# Altium project jetson-orin-baseboard.PrjPcb (part 2 of 5)

## Sheet supply.SchDoc
size 420 x 297 mm
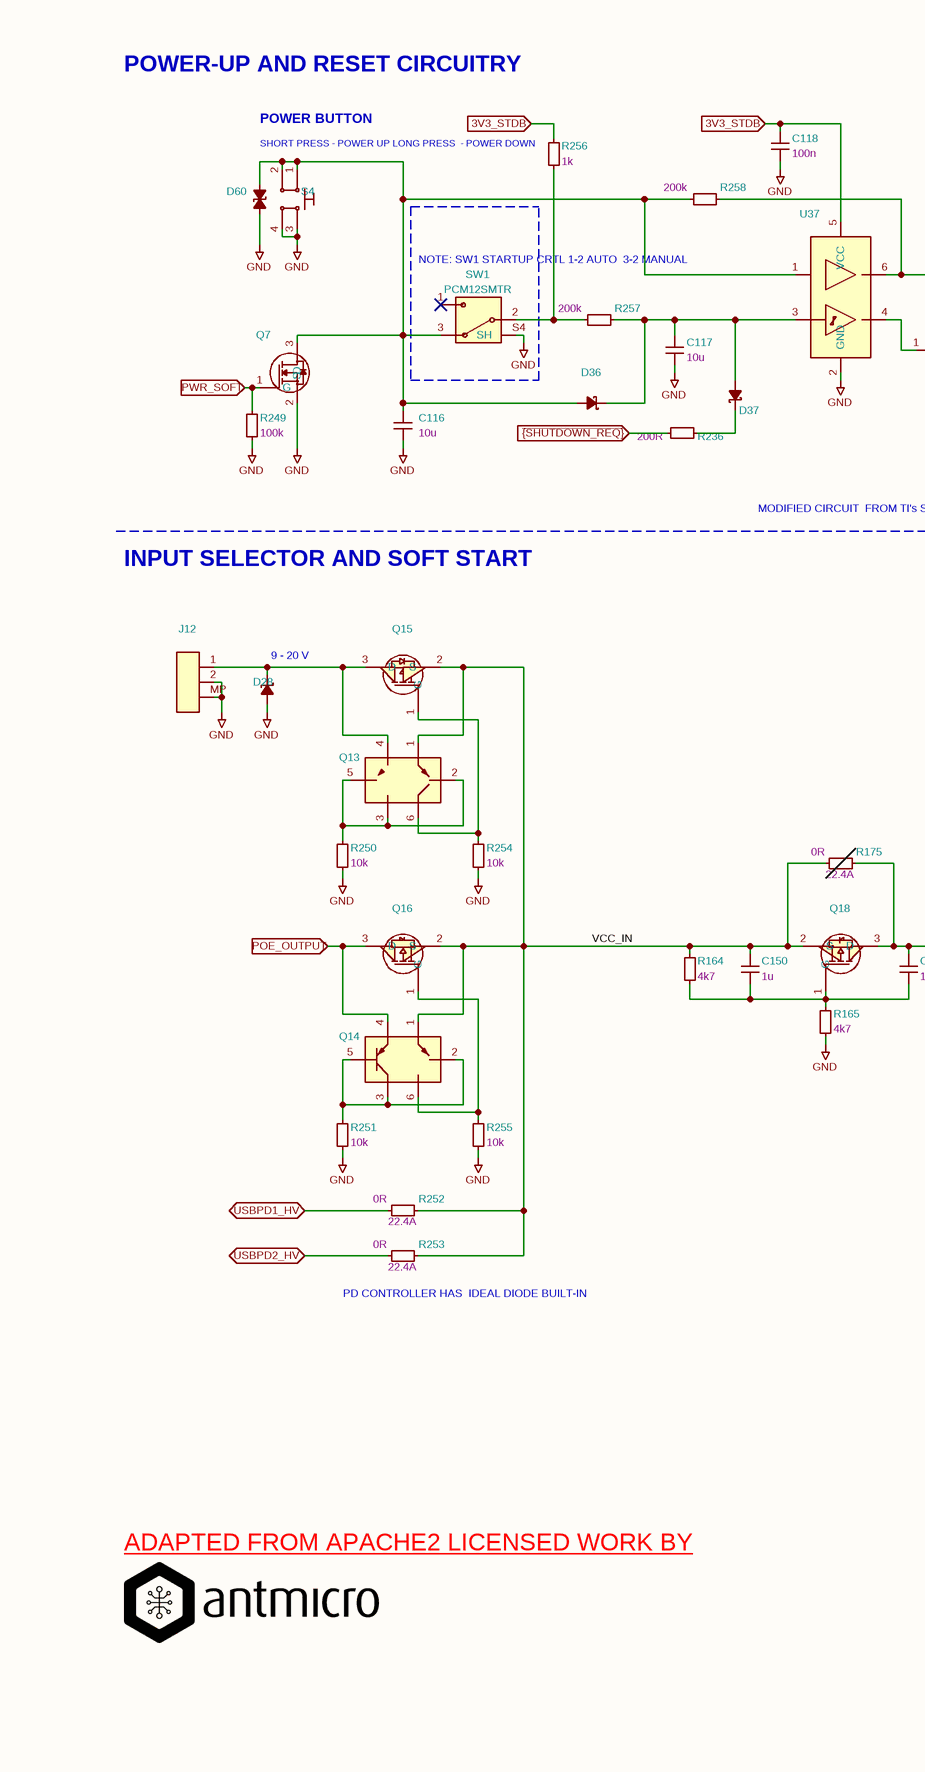
[diagram p3: supply.SchDoc, left]
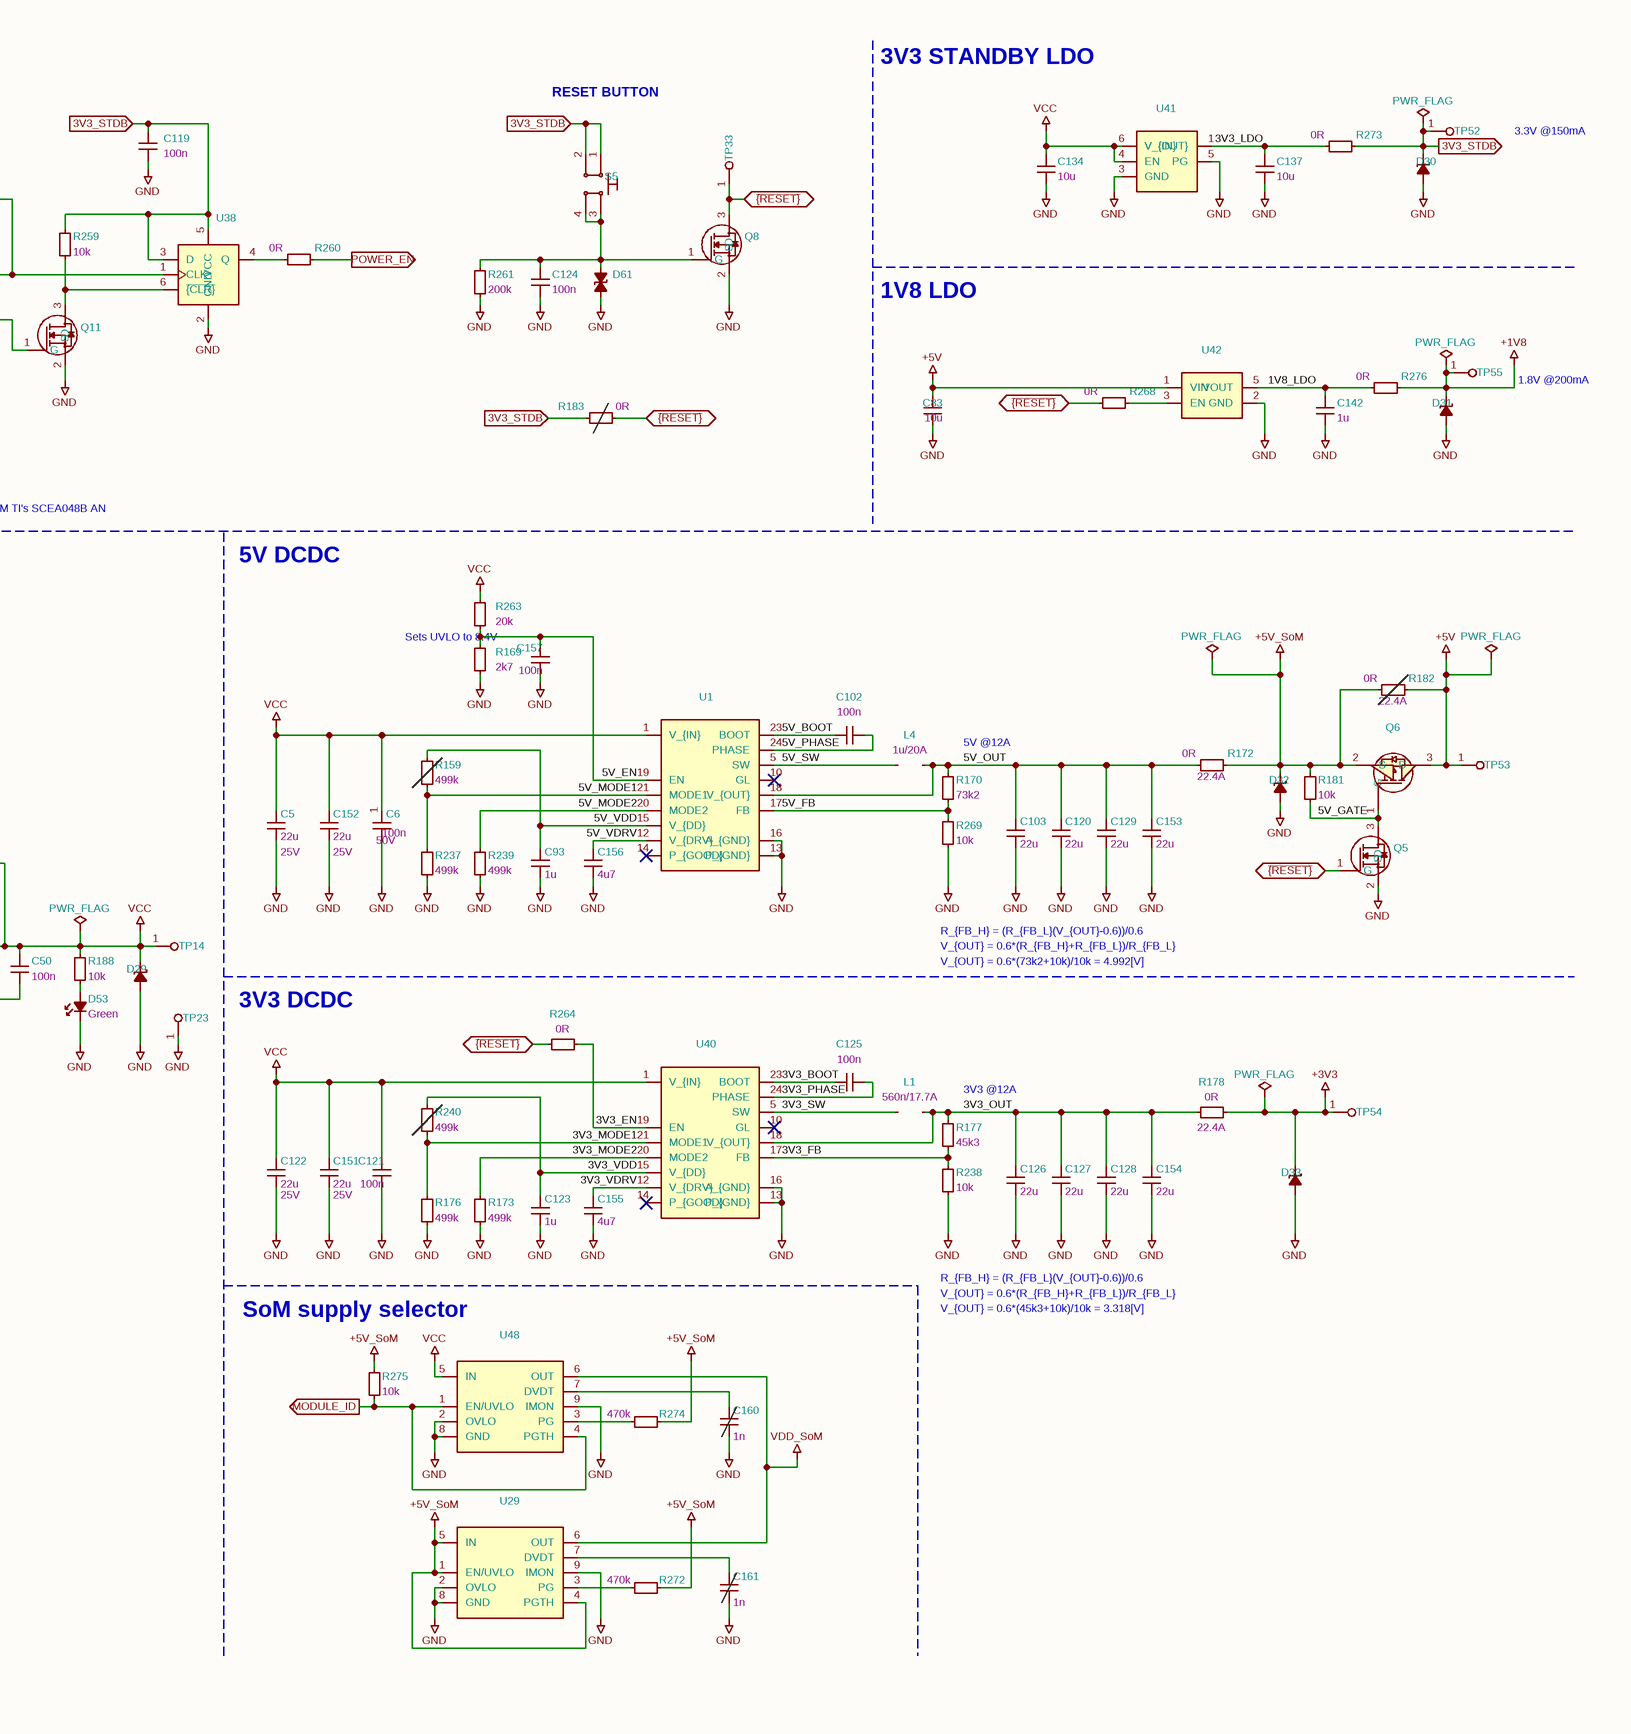
[diagram p4: supply.SchDoc, right]

### Parts
#FLG01  PWR_FLAG  (graphical)
#FLG03  PWR_FLAG  (graphical)
#FLG04  PWR_FLAG  (graphical)
#FLG05  PWR_FLAG  (graphical)
#FLG06  PWR_FLAG  (graphical)
#FLG011  PWR_FLAG  (graphical)
C5  Val: 22u  Voltage: 25V  [C_0805_2012Metric]  (hidden comment: CL21A226MAYNNNE)
C6  Val: 100n  Voltage: 50V  [C_0402_1005Metric]  (hidden comment: GRM155R61H104KE14D)
C50  Val: 100n  [C_0402_1005Metric]  (hidden comment: GRM155R61H104KE14D)
C83  Val: 10u  [C_0402_1005Metric]  (hidden comment: CC0402MRX5R5BB106)
C93  Val: 1u  [C_0402_1005Metric]  (hidden comment: C1005X6S1A105K050BC)
C102  Val: 100n  [C_0402_1005Metric]  (hidden comment: GRM155R61H104KE14D)
C103  Val: 22u  [C_0603_1608Metric_EIA]  (hidden comment: CL10A226MO7JZNC)
C116  Val: 10u  [C_0402_1005Metric]  (hidden comment: CC0402MRX5R5BB106)
C117  Val: 10u  [C_0402_1005Metric]  (hidden comment: CC0402MRX5R5BB106)
C118  Val: 100n  [C_0402_1005Metric]  (hidden comment: GRM155R61H104KE14D)
C119  Val: 100n  [C_0402_1005Metric]  (hidden comment: GRM155R61H104KE14D)
C120  Val: 22u  [C_0603_1608Metric_EIA]  (hidden comment: CL10A226MO7JZNC)
C121  Val: 100n  [C_0402_1005Metric]  (hidden comment: GRM155R61H104KE14D)
C122  Val: 22u  Voltage: 25V  [C_0805_2012Metric]  (hidden comment: CL21A226MAYNNNE)
C123  Val: 1u  [C_0402_1005Metric]  (hidden comment: C1005X6S1A105K050BC)
C124  Val: 100n  [C_0402_1005Metric]  (hidden comment: GRM155R61H104KE14D)
C125  Val: 100n  [C_0402_1005Metric]  (hidden comment: GRM155R61H104KE14D)
C126  Val: 22u  [C_0603_1608Metric_EIA]  (hidden comment: CL10A226MO7JZNC)
C127  Val: 22u  [C_0603_1608Metric_EIA]  (hidden comment: CL10A226MO7JZNC)
C128  Val: 22u  [C_0603_1608Metric_EIA]  (hidden comment: CL10A226MO7JZNC)
C129  Val: 22u  [C_0603_1608Metric_EIA]  (hidden comment: CL10A226MO7JZNC)
C134  Val: 10u  [C_0603_1608Metric]  (hidden comment: C1608X5R1E106M080AC)
C137  Val: 10u  [C_0402_1005Metric]  (hidden comment: CC0402MRX5R5BB106)
C142  Val: 1u  [C_0402_1005Metric]  (hidden comment: C1005X6S1A105K050BC)
C150  Val: 1u  [C_0402_1005Metric]  (hidden comment: GRM155R61E105KE11J)
C151  Val: 22u  Voltage: 25V  [C_0805_2012Metric]  (hidden comment: CL21A226MAYNNNE)
C152  Val: 22u  Voltage: 25V  [C_0805_2012Metric]  (hidden comment: CL21A226MAYNNNE)
C153  Val: 22u  [C_0603_1608Metric_EIA]  (hidden comment: CL10A226MO7JZNC)
C154  Val: 22u  [C_0603_1608Metric_EIA]  (hidden comment: CL10A226MO7JZNC)
C155  Val: 4u7  [C_0402_1005Metric]  (hidden comment: GRM155C61E475ME15J)
C156  Val: 4u7  [C_0402_1005Metric]  (hidden comment: GRM155C61E475ME15J)
C157  Val: 100n  [C_0402_1005Metric]  (hidden comment: GRM155R61H104KE14D)
C160  Val: 1n  [C_0402_1005Metric]  (hidden comment: GRM1555C1H102JA01D)  (no BOM)
C161  Val: 1n  [C_0402_1005Metric]  (hidden comment: GRM1555C1H102JA01D)  (no BOM)
D28  DF2S30FS  [SOD-923]  (value not drawn)
D29  DF2S30FS  [SOD-923]  (value not drawn)
D30  ESD9X5.0ST5G  [SOD-923]  (value not drawn)
D31  ESD9X5.0ST5G  [SOD-923]  (value not drawn)
D32  ESD9X5.0ST5G  [SOD-923]  (value not drawn)
D33  ESD9X5.0ST5G  [SOD-923]  (value not drawn)
D36  RB521S30T1G  [SOD-523]  (value not drawn)
D37  RB521S30T1G  [SOD-523]  (value not drawn)
D53  Color: Green  [LED_0603_1608Metric_G]  (hidden comment: LTST-C190GKT)
D60  TPD1E0B04DPYR  [XDFN-2_1x0.60mm]  (value not drawn)
D61  TPD1E0B04DPYR  [XDFN-2_1x0.60mm]  (value not drawn)
J12  105430-1202  [Conn_Molex_Nano-Fit_1x2_SMD_1054301202]  (value not drawn)
L1  Val: 560n/17.7A  [L_Bourns-SRP5030CA]  (hidden comment: SRP5030CA-R56M)
L4  Val: 1u/20A  [L_Bourns-SRP6050CA]  (hidden comment: SRP6050CA-1R0M)
Q5  PJE138K_R1_00001  [SOT-523]  (value not drawn)
Q6  SSM3J332R,LF  [SOT-23-3]  (value not drawn)
Q7  PJE138K_R1_00001  [SOT-523]  (value not drawn)
Q8  PJE138K_R1_00001  [SOT-523]  (value not drawn)
Q11  PJE138K_R1_00001  [SOT-523]  (value not drawn)
Q13  BCM857BS-7-F  [SOT-363]  (value not drawn)
Q14  BCM857BS-7-F  [SOT-363]  (value not drawn)
Q15  SSM3J332R,LF  [SOT-23-3]  (value not drawn)
Q16  SSM3J332R,LF  [SOT-23-3]  (value not drawn)
Q18  SSM3J332R,LF  [SOT-23-3]  (value not drawn)
R159  Val: 499k  [R_0402_1005Metric]  (hidden comment: CR0402-FX-4993GLF)  (no BOM)
R164  Val: 4k7  [R_0402_1005Metric]  (hidden comment: CR0402-FX-4701GLF)
R165  Val: 4k7  [R_0402_1005Metric]  (hidden comment: CR0402-FX-4701GLF)
R169  Val: 2k7  [R_0402_1005Metric]  (hidden comment: CR0402-FX-2701GLF)
R170  Val: 73k2  [R_0402_1005Metric]  (hidden comment: CR0402-FX-7322GLF)
R172  Val: 0R  Max. Curr.: 22.4A  [R_0603_1608Metric]  (hidden comment: PMR03EZPJ000)
R173  Val: 499k  [R_0402_1005Metric]  (hidden comment: CR0402-FX-4993GLF)
R175  Val: 0R  Max. Curr.: 22.4A  [R_0603_1608Metric]  (hidden comment: PMR03EZPJ000)  (no BOM)
R176  Val: 499k  [R_0402_1005Metric]  (hidden comment: CR0402-FX-4993GLF)
R177  Val: 45k3  [R_0402_1005Metric]  (hidden comment: CR0402-FX-4532GLF)
R178  Val: 0R  Max. Curr.: 22.4A  [R_0603_1608Metric]  (hidden comment: PMR03EZPJ000)
R181  Val: 10k  [R_0402_1005Metric]  (hidden comment: CR0402-FX-1002GLF)
R182  Val: 0R  Max. Curr.: 22.4A  [R_0603_1608Metric]  (hidden comment: PMR03EZPJ000)  (no BOM)
R183  Val: 0R  [R_0402_1005Metric]  (hidden comment: ERJ2GE0R00X)  (no BOM)
R188  Val: 10k  [R_0402_1005Metric]  (hidden comment: CR0402-FX-1002GLF)
R236  Val: 200R  [R_0402_1005Metric]  (hidden comment: CR0402-FX-2000GLF)
R237  Val: 499k  [R_0402_1005Metric]  (hidden comment: CR0402-FX-4993GLF)
R238  Val: 10k  [R_0402_1005Metric]  (hidden comment: CR0402-FX-1002GLF)
R239  Val: 499k  [R_0402_1005Metric]  (hidden comment: CR0402-FX-4993GLF)
R240  Val: 499k  [R_0402_1005Metric]  (hidden comment: CR0402-FX-4993GLF)  (no BOM)
R249  Val: 100k  [R_0402_1005Metric]  (hidden comment: CR0402-FX-1003GLF)
R250  Val: 10k  [R_0402_1005Metric]  (hidden comment: CR0402-FX-1002GLF)
R251  Val: 10k  [R_0402_1005Metric]  (hidden comment: CR0402-FX-1002GLF)
R252  Val: 0R  Max. Curr.: 22.4A  [R_0603_1608Metric]  (hidden comment: PMR03EZPJ000)
R253  Val: 0R  Max. Curr.: 22.4A  [R_0603_1608Metric]  (hidden comment: PMR03EZPJ000)
R254  Val: 10k  [R_0402_1005Metric]  (hidden comment: CR0402-FX-1002GLF)
R255  Val: 10k  [R_0402_1005Metric]  (hidden comment: CR0402-FX-1002GLF)
R256  Val: 1k  [R_0402_1005Metric]  (hidden comment: CR0402-FX-1001GLF)
R257  Val: 200k  [R_0402_1005Metric]  (hidden comment: CR0402-FX-2003GLF)
R258  Val: 200k  [R_0402_1005Metric]  (hidden comment: CR0402-FX-2003GLF)
R259  Val: 10k  [R_0402_1005Metric]  (hidden comment: CR0402-FX-1002GLF)
R260  Val: 0R  [R_0402_1005Metric]  (hidden comment: ERJ2GE0R00X)
R261  Val: 200k  [R_0402_1005Metric]  (hidden comment: CR0402-FX-2003GLF)
R263  Val: 20k  [R_0402_1005Metric]  (hidden comment: CR0402-FX-2002GLF)
R264  Val: 0R  [R_0402_1005Metric]  (hidden comment: ERJ2GE0R00X)
R268  Val: 0R  [R_0402_1005Metric]  (hidden comment: ERJ2GE0R00X)
R269  Val: 10k  [R_0402_1005Metric]  (hidden comment: CR0402-FX-1002GLF)
R272  Val: 470k  [R_0402_1005Metric]  (hidden comment: CR0402-FX-4703GLF)
R273  Val: 0R  [R_0603_1608Metric]  (hidden comment: CR0603-J/-000ELF)
R274  Val: 470k  [R_0402_1005Metric]  (hidden comment: CR0402-FX-4703GLF)
R275  Val: 10k  [R_0402_1005Metric]  (hidden comment: CR0402-FX-1002GLF)
R276  Val: 0R  [R_0603_1608Metric]  (hidden comment: CR0603-J/-000ELF)
S4  KMR211NGLFS  [SW_KMR211NGLFS_SMD]  (value not drawn)
S5  KMR211NGLFS  [SW_KMR211NGLFS_SMD]  (value not drawn)
SW1  PCM12SMTR  [PCM12SMTR]
TP14  TP_0.75mm_SMD  [TP_SMD_0.75mm]  (value not drawn)  (no BOM)
TP23  TP_0.75mm_SMD  [TP_SMD_0.75mm]  (value not drawn)  (no BOM)
TP33  TP_0.75mm_SMD  [TP_SMD_0.75mm]  (value not drawn)  (no BOM)
TP52  TP_0.75mm_SMD  [TP_SMD_0.75mm]  (value not drawn)  (no BOM)
TP53  TP_0.75mm_SMD  [TP_SMD_0.75mm]  (value not drawn)  (no BOM)
TP54  TP_0.75mm_SMD  [TP_SMD_0.75mm]  (value not drawn)  (no BOM)
TP55  TP_0.75mm_SMD  [TP_SMD_0.75mm]  (value not drawn)  (no BOM)
U1  SIC431AED-T1-GE3  [MLP44-24L_4x4x0.75mm]  (value not drawn)
U29  LM73100RPWR  [VQFN-HR-10_2x2mm]  (value not drawn)
U37  74LVC2G14GV,125  [SOT-23-6]  (value not drawn)
U38  74LVC1G175GV,125  [SOT-23-6]  (value not drawn)
U40  SIC431AED-T1-GE3  [MLP44-24L_4x4x0.75mm]  (value not drawn)
U41  NCP730BMT330TBG  [WSON-6-1EP_2x2mm_P0.65mm]  (value not drawn)
U42  TPS7A0518PDBVT  [SOT-23-5]  (value not drawn)
U48  LM73100RPWR  [VQFN-HR-10_2x2mm]  (value not drawn)

### Blocks framed on the sheet
NOTE: / SW1 STARTUP CRTL / 1-2 AUTO / 3-2 MANUAL: SW1

### Ports
3V3_STDB (in), 3V3_STDB (out), MODULE_ID (out), POE_OUTPUT (in), POWER_EN (out), PWR_SOFT (in), USBPD1_HV (bidir), USBPD2_HV (bidir), ~{{RESET}} (bidir), ~{{SHUTDOWN_REQ}} (in)

### Nets
+1V8: #FLG03.1(pwr) D31.1(C) R276.2 TP55.1
+3V3: #FLG06.1(pwr) D33.1(C) R178.2 TP54.1
+5V: #FLG05.1(pwr) C83.1 Q6.3(D) R182.2 TP53.1 U42.1(VIN)
+5V_SoM: #FLG04.1(pwr) D32.1(C) Q6.2(S) R172.2 R181.2 R182.1 R272.1 R274.1 R275.2 U29.1(EN/UVLO) U29.4(PGTH) U29.5(IN)
GND: C5.1 C6.2 C83.2 C93.1 C103.1 C116.1 C117.1 C118.1 C119.1 C120.1 C121.2 C122.1 C123.1 C124.1 C126.1 C127.1 C128.1 C129.1 C134.1 C137.1 C142.1 C151.1 C152.1 C153.1 C154.1 C155.1 C156.1 C157.2 C160.1 C161.1 D28.2(A) D29.2(A) D30.2(A) D31.2(A) D32.2(A) D33.2(A) D53.1(C) D60.1(C) D61.1(C) J12.2 J12.MP Q5.2(S) Q7.2(S) Q8.2(S) Q11.2(S) R165.1 R169.1 R173.1 R176.1 R237.1 R238.1 R239.1 R249.1 R250.1 R251.1 R254.1 R255.1 R261.1 R269.1 S4.3 S4.4 SW1.S4(SH) TP23.1 U1.13(P_{GND}) U1.16(A_{GND}) U29.2(OVLO) U29.8(GND) U29.9(IMON) U37.2(GND) U38.2(GND) U40.13(P_{GND}) U40.16(A_{GND}) U41.3(GND) U41.5(PG) U42.2(GND) U48.2(OVLO) U48.8(GND) U48.9(IMON)
VCC: #FLG011.1(pwr) C5.2 C6.1 C50.2 C121.1 C122.2 C134.2 C151.2 C152.2 D29.1(C) Q18.3(D) R175.2 R188.2 R263.2 TP14.1 U1.1(V_{IN}) U40.1(V_{IN}) U41.4(EN) U41.6(V_{IN}) U48.5(IN)
VDD_SoM: U29.6(OUT) U48.6(OUT)
1V8_LDO: C142.2 R276.1 U42.5(VOUT)
3V3_BOOT: C125.2 U40.23(BOOT)
3V3_EN: R264.2 U40.19(EN)
3V3_FB: R177.1 R238.2 U40.17(FB)
3V3_LDO: C137.2 R273.1 U41.1(V_{OUT})
3V3_MODE1: R176.2 R240.1 U40.21(MODE1)
3V3_MODE2: R173.2 U40.20(MODE2)
3V3_OUT: C126.2 C127.2 C128.2 C154.2 L1.2 R177.2 R178.1 U40.18(V_{OUT})
3V3_PHASE: C125.1 U40.24(PHASE)
3V3_STDB: #FLG01.1(pwr) C118.2 C119.2 D30.1(C) R183.2 R256.2 R259.2 R273.2 S5.1 S5.2 TP52.1 U37.5(VCC) U38.3(D) U38.5(VCC) ; port 3V3_STDB
3V3_SW: L1.1 U40.5(SW)
3V3_VDD: C123.2 R240.2 U40.15(V_{DD})
3V3_VDRV: C155.2 U40.12(V_{DRV})
5V_BOOT: C102.2 U1.23(BOOT)
5V_EN: C157.1 R169.2 R263.1 U1.19(EN)
5V_FB: R170.1 R269.2 U1.17(FB)
5V_GATE: Q5.3(D) Q6.1(G) R181.1
5V_MODE1: R159.1 R237.2 U1.21(MODE1)
5V_MODE2: R239.2 U1.20(MODE2)
5V_OUT: C103.2 C120.2 C129.2 C153.2 L4.2 R170.2 R172.1 U1.18(V_{OUT})
5V_PHASE: C102.1 U1.24(PHASE)
5V_SW: L4.1 U1.5(SW)
5V_VDD: C93.2 R159.2 U1.15(V_{DD})
5V_VDRV: C156.2 U1.12(V_{DRV})
MODULE_ID: R275.1 U48.1(EN/UVLO) U48.4(PGTH) ; port MODULE_ID
POE_OUTPUT: Q14.4 Q16.3(D) ; port POE_OUTPUT
POWER_EN: R260.2 ; port POWER_EN
PWR_SOFT: Q7.1(G) R249.2 ; port PWR_SOFT
USBPD1_HV: R252.1 ; port USBPD1_HV
USBPD2_HV: R253.1 ; port USBPD2_HV
VCC_IN: C150.2 Q13.1 Q14.1 Q15.2(S) Q16.2(S) Q18.2(S) R164.2 R175.1 R252.2 R253.2
~{{RESET}}: Q5.1(G) Q8.3(D) R183.1 R264.1 R268.1 TP33.1 ; port ~{{RESET}}
~{{SHUTDOWN_REQ}}: R236.2 ; port ~{{SHUTDOWN_REQ}}
NetC50_1: C50.1 C150.1 Q18.1(G) R164.1 R165.2
NetC116_2: C116.2 D36.2(A) D60.2(A) Q7.3(D) R258.1 S4.1 S4.2 SW1.3 U37.1
NetC117_2: C117.2 D36.1(C) D37.2(A) R257.2 U37.3
NetC124_2: C124.2 D61.2(A) Q8.1(G) R261.2 S5.3 S5.4
NetC160_2: C160.2 U48.7(DVDT)
NetC161_2: C161.2 U29.7(DVDT)
NetD28_1: D28.1(C) J12.1 Q13.4 Q15.3(D)
NetD37_1: D37.1(C) R236.1
NetD53_2: D53.2(A) R188.1
NetQ11_1: Q11.1(G) U37.4
NetQ11_3: Q11.3(D) R259.1 U38.6(~{{CLR}})
NetQ13_2: Q13.2 Q13.3 Q13.5 R250.2
NetQ13_6: Q13.6 Q15.1(G) R254.2
NetQ14_2: Q14.2 Q14.3 Q14.5 R251.2
NetQ14_6: Q14.6 Q16.1(G) R255.2
NetR256_1: R256.1 R257.1 SW1.2
NetR258_2: R258.2 U37.6 U38.1(CLK)
NetR260_1: R260.1 U38.4(Q)
NetR268_2: R268.2 U42.3(EN)
NetR272_2: R272.2 U29.3(PG)
NetR274_2: R274.2 U48.3(PG)

Not connected (* = marked no-connect by the designer): SW1 1* S1(SH) S2(SH) S3(SH); U1 2(V_{IN}) 3(P_{GND}) 4(P_{GND}) 6(SW) 7(SW) 8(SW) 9(SW) 10(GL)* 11(GL) 14(P_{GOOD})* 22(V_{IN}) 25(A_{GND}) 26(V_{IN}) 27(P_{GND}) 28(GL); U29 10(DNC); U40 2(V_{IN}) 3(P_{GND}) 4(P_{GND}) 6(SW) 7(SW) 8(SW) 9(SW) 10(GL)* 11(GL) 14(P_{GOOD})* 22(V_{IN}) 25(A_{GND}) 26(V_{IN}) 27(P_{GND}) 28(GL); U41 2(NC) 7(GND); U42 4(NC); U48 10(DNC)

### Notes on the sheet
- POWER-UP AND RESET CIRCUITRY
- RESET BUTTON
- 3V3 STANDBY LDO
- SHORT PRESS - POWER UP
  LONG PRESS  - POWER DOWN
- POWER BUTTON
- 3.3V
  @150mA
- 1V8 LDO
- 1.8V
  @200mA
- MODIFIED CIRCUIT
  FROM TI's SCEA048B AN
- INPUT SELECTOR AND SOFT START
- 5V DCDC
- (near D28) 9 - 20 V
- Sets UVLO to 8.4V
- 5V @12A
- 3V3 DCDC
- V_{OUT} = 0.6*(R_{FB_H}+R_{FB_L})/R_{FB_L}
- V_{OUT} = 0.6*(73k2+10k)/10k = 4.992[V]
- R_{FB_H} = (R_{FB_L}(V_{OUT}-0.6))/0.6
- 3V3 @12A
- (near R253) PD CONTROLLER HAS
  IDEAL DIODE BUILT-IN
- V_{OUT} = 0.6*(45k3+10k)/10k = 3.318[V]
- SoM supply selector
- ADAPTED FROM APACHE2 LICENSED WORK BY <https://github.com/antmicro/jetson-orin-baseboard>
- 1
- 2
- 3
- 4
- 5
- 6
- 7
- 8
- A
- B
- C
- D
- E
- www.antmicro.com <http://www.antmicro.com>
- Title: Jetson Orin Baseboard
- File: supply.kicad_sch
- Sheet: /
- Antmicro Ltd
- F
- KiCad E.D.A.  kicad (5.1.4)-1
- Size: A3
- Date: 2025-01-15
- Rev: 1.3.0
- Id: 1/1

### Library data of the parts
C5 C122 C151 C152 = C_22u_25V_0805: Manufacturer 1: Samsung Electro-Mechanics; License: Apache-2.0; Dielectric: X5R; Public: False; Author: Antmicro; OldValue: C_22u_25V_0805; Manufacturer Part Number 1: CL21A226MAYNNNE; Value: CL21A226MAYNNNE; Footprint: antmicro-footprints:C_0805_2012Metric
C6 = C_100n_0402: Manufacturer 1: Murata; License: Apache-2.0; Dielectric: X5R; Author: Antmicro; OldValue: C_100n_0402; Manufacturer Part Number 1: GRM155R61H104KE14D; Value: GRM155R61H104KE14D; Footprint: antmicro-footprints:C_0402_1005Metric
C50 C102 C118 C119 C121 C124 C125 C157 = C_100n_0402: as C86 on sheet hdmi; Author: Antmicro; OldValue: C_100n_0402; Manufacturer Part Number 1: GRM155R61H104KE14D; Value: GRM155R61H104KE14D; Footprint: antmicro-footprints:C_0402_1005Metric
C83 C116 C117 C137 = C_10u_0402: Manufacturer 1: YAGEO; License: Apache-2.0; Author: Antmicro; OldValue: C_10u_0402; Manufacturer Part Number 1: CC0402MRX5R5BB106; Value: CC0402MRX5R5BB106; Footprint: antmicro-footprints:C_0402_1005Metric
C93 C123 C142 = C_1u_0402: Manufacturer 1: TDK; License: Apache-2.0; Author: Antmicro; OldValue: C_1u_0402; Manufacturer Part Number 1: C1005X6S1A105K050BC; Value: C1005X6S1A105K050BC; Footprint: antmicro-footprints:C_0402_1005Metric
C103 C120 C126-C129 C153 C154 = C_22u_16V_0603: Manufacturer 1: Samsung Electro-Mechanics; License: Apache-2.0; Voltage: 16V; Author: Antmicro; OldValue: C_22u_16V_0603; Manufacturer Part Number 1: CL10A226MO7JZNC; Value: CL10A226MO7JZNC; Footprint: antmicro-footprints:C_0603_1608Metric_EIA
C134 = C_10u_25V_0603: Manufacturer 1: TDK; License: Apache-2.0; Voltage: 25V; Author: Antmicro; OldValue: C_10u_25V_0603; Manufacturer Part Number 1: C1608X5R1E106M080AC; Value: C1608X5R1E106M080AC; Footprint: antmicro-footprints:C_0603_1608Metric
C150 = C_1u_25V_0402: Manufacturer 1: Murata; License: Apache-2.0; Voltage: 25V; Dielectric: X5R; Author: Antmicro; OldValue: C_1u_25V_0402; Manufacturer Part Number 1: GRM155R61E105KE11J; Value: GRM155R61E105KE11J; Footprint: antmicro-footprints:C_0402_1005Metric
C155 C156 = C_4u7_25V_0402: Manufacturer 1: Murata; License: Apache-2.0; Voltage: 25V; Dielectric: X5S; Author: Antmicro; OldValue: C_4u7_25V_0402; Manufacturer Part Number 1: GRM155C61E475ME15J; Value: GRM155C61E475ME15J; Footprint: antmicro-footprints:C_0402_1005Metric
C160 C161 = C_1n_0402: Manufacturer 1: Murata; License: Apache-2.0; Voltage: 50V; Dielectric: C0G; Author: Antmicro; OldValue: C_1n_0402; Manufacturer Part Number 1: GRM1555C1H102JA01D; Value: GRM1555C1H102JA01D; Footprint: antmicro-footprints:C_0402_1005Metric
D28 D29 = DF2S30FS_SOD: Manufacturer 1: Toshiba; License: Apache-2.0; Author: Antmicro; OldValue: DF2S30FS_SOD; Manufacturer Part Number 1: DF2S30FS; Value: DF2S30FS; Footprint: antmicro-footprints:SOD-923
D30-D33 = ESD9X5.0ST5G: Manufacturer 1: ON Semiconductor; License: Apache-2.0; Author: Antmicro; OldValue: ESD9X5.0ST5G; Manufacturer Part Number 1: ESD9X5.0ST5G; Value: ESD9X5.0ST5G; Footprint: antmicro-footprints:SOD-923
D36 D37 = RB521S30T1G: as D38 on sheet hdmi; Author: Antmicro; OldValue: RB521S30T1G; Manufacturer Part Number 1: RB521S30T1G; Value: RB521S30T1G; Footprint: antmicro-footprints:SOD-523
D53 = LED_G_0603_LTST-C190GKT: Manufacturer 1: Lite-On; License: Apache-2.0; Author: Antmicro; OldValue: LED_G_0603_LTST-C190GKT; Manufacturer Part Number 1: LTST-C190GKT; Value: LTST-C190GKT; Footprint: antmicro-footprints:LED_0603_1608Metric_G
D60 D61 = TPD1E0B04_XDFN-2: Manufacturer 1: Texas Instruments; License: Apache-2.0; Author: Antmicro; OldValue: TPD1E0B04_XDFN-2; Manufacturer Part Number 1: TPD1E0B04DPYR; Value: TPD1E0B04DPYR; Footprint: antmicro-footprints:XDFN-2_1x0.60mm
J12 = Molex_Nano-Fit_1x2_SMD_1054301202: Manufacturer 1: Molex; License: Apache-2.0; Author: Antmicro; OldValue: Molex_Nano-Fit_1x2_SMD_1054301202; Manufacturer Part Number 1: 105430-1202; Value: 105430-1202; Footprint: antmicro-footprints:Conn_Molex_Nano-Fit_1x2_SMD_1054301202
L1 = L_560n_17.7A_Bourns-SRP5030CA: Manufacturer 1: Bourns; ISat: 22.2 A; IMax: 17.7 A; License: Apache-2.0; Size: 5.5x5.3; Author: Antmicro; OldValue: L_560n_17.7A_Bourns-SRP5030CA; Manufacturer Part Number 1: SRP5030CA-R56M; Value: SRP5030CA-R56M; Footprint: antmicro-footprints:L_Bourns-SRP5030CA
L4 = L_1u_20A_Bourns-SRP6050CA: Manufacturer 1: Bourns; ISat: 23 A; IMax: 20 A; License: Apache-2.0; Size: 6.6x6.4; Author: Antmicro; OldValue: L_1u_20A_Bourns-SRP6050CA; Manufacturer Part Number 1: SRP6050CA-1R0M; Value: SRP6050CA-1R0M; Footprint: antmicro-footprints:L_Bourns-SRP6050CA
Q5 Q7 Q8 Q11 = PJE138K: Manufacturer 1: PANJIT; License: Apache-2.0; Author: Antmicro; OldValue: PJE138K; Manufacturer Part Number 1: PJE138K_R1_00001; Value: PJE138K_R1_00001; Footprint: antmicro-footprints:SOT-523
Q6 Q15 Q16 Q18 = SSM3J332R: Manufacturer 1: Toshiba; License: Apache-2.0; Author: Antmicro; OldValue: SSM3J332R; Manufacturer Part Number 1: SSM3J332R,LF; Value: SSM3J332R,LF; Footprint: antmicro-footprints:SOT-23-3
Q13 Q14 = BCM857BS-7-F: Manufacturer 1: Diodes Incorporated; License: Apache-2.0; Author: Antmicro; OldValue: BCM857BS-7-F; Manufacturer Part Number 1: BCM857BS-7-F; Value: BCM857BS-7-F; Footprint: antmicro-footprints:SOT-363
R159 R173 R176 R237 R239 R240 = R_499k_0402: Manufacturer 1: Bourns; License: Apache-2.0; Tolerance: 1%; Author: Antmicro; OldValue: R_499k_0402; Manufacturer Part Number 1: CR0402-FX-4993GLF; Value: CR0402-FX-4993GLF; Footprint: antmicro-footprints:R_0402_1005Metric
R164 R165 = R_4k7_0402: Manufacturer 1: Bourns; License: Apache-2.0; Tolerance: 1%; Author: Antmicro; OldValue: R_4k7_0402; Manufacturer Part Number 1: CR0402-FX-4701GLF; Value: CR0402-FX-4701GLF; Footprint: antmicro-footprints:R_0402_1005Metric
R169 = R_2k7_0402: Manufacturer 1: Bourns; License: Apache-2.0; Tolerance: 1%; Author: Antmicro; OldValue: R_2k7_0402; Manufacturer Part Number 1: CR0402-FX-2701GLF; Value: CR0402-FX-2701GLF; Footprint: antmicro-footprints:R_0402_1005Metric
R170 = R_73k2_0402: Manufacturer 1: Bourns; License: Apache-2.0; Tolerance: 1%; Author: Antmicro; OldValue: R_73k2_0402; Manufacturer Part Number 1: CR0402-FX-7322GLF; Value: CR0402-FX-7322GLF; Footprint: antmicro-footprints:R_0402_1005Metric
R172 R175 R178 R182 R252 R253 = R_0R_22.4A_0603: Manufacturer 1: ROHM Semiconductor; License: Apache-2.0; Tolerance: template_tolerance; Author: Antmicro; OldValue: R_0R_22.4A_0603; Manufacturer Part Number 1: PMR03EZPJ000; Value: PMR03EZPJ000; Footprint: antmicro-footprints:R_0603_1608Metric
R177 = R_45k3_0402: Manufacturer 1: Bourns; License: Apache-2.0; Tolerance: 1%; Author: Antmicro; OldValue: R_45k3_0402; Manufacturer Part Number 1: CR0402-FX-4532GLF; Value: CR0402-FX-4532GLF; Footprint: antmicro-footprints:R_0402_1005Metric
R181 R188 R238 R250 R251 R254 R255 R259 R269 R275 = R_10k_0402: Manufacturer 1: Bourns; License: Apache-2.0; Tolerance: 1%; Author: Antmicro; OldValue: R_10k_0402; Manufacturer Part Number 1: CR0402-FX-1002GLF; Value: CR0402-FX-1002GLF; Footprint: antmicro-footprints:R_0402_1005Metric
R183 R260 R264 R268 = R_0R_0402: as R40 on sheet hdmi; Author: Antmicro; OldValue: R_0R_0402; Manufacturer Part Number 1: ERJ2GE0R00X; Value: ERJ2GE0R00X; Footprint: antmicro-footprints:R_0402_1005Metric
R236 = R_200R_0402: Manufacturer 1: Bourns; License: Apache-2.0; Tolerance: 1%; Author: Antmicro; OldValue: R_200R_0402; Manufacturer Part Number 1: CR0402-FX-2000GLF; Value: CR0402-FX-2000GLF; Footprint: antmicro-footprints:R_0402_1005Metric
R249 = R_100k_0402: Manufacturer 1: Bourns; License: Apache-2.0; Tolerance: 1%; Author: Antmicro; OldValue: R_100k_0402; Manufacturer Part Number 1: CR0402-FX-1003GLF; Value: CR0402-FX-1003GLF; Footprint: antmicro-footprints:R_0402_1005Metric
R256 = R_1k_0402: Manufacturer 1: Bourns; License: Apache-2.0; Tolerance: 1%; Author: Antmicro; OldValue: R_1k_0402; Manufacturer Part Number 1: CR0402-FX-1001GLF; Value: CR0402-FX-1001GLF; Footprint: antmicro-footprints:R_0402_1005Metric
R257 R258 R261 = R_200k_0402: Manufacturer 1: Bourns; License: Apache-2.0; Tolerance: 1%; Author: Antmicro; OldValue: R_200k_0402; Manufacturer Part Number 1: CR0402-FX-2003GLF; Value: CR0402-FX-2003GLF; Footprint: antmicro-footprints:R_0402_1005Metric
R263 = R_20k_0402: Manufacturer 1: Bourns; License: Apache-2.0; Tolerance: 1%; Author: Antmicro; OldValue: R_20k_0402; Manufacturer Part Number 1: CR0402-FX-2002GLF; Value: CR0402-FX-2002GLF; Footprint: antmicro-footprints:R_0402_1005Metric
R272 R274 = R_470k_0402: Manufacturer 1: Bourns; License: Apache-2.0; Tolerance: 1%; Author: Antmicro; OldValue: R_470k_0402; Manufacturer Part Number 1: CR0402-FX-4703GLF; Value: CR0402-FX-4703GLF; Footprint: antmicro-footprints:R_0402_1005Metric
R273 R276 = R_0R_0603: Manufacturer 1: Bourns; License: Apache-2.0; Tolerance: ~; Current: 1A; Author: Antmicro; OldValue: R_0R_0603; Manufacturer Part Number 1: CR0603-J/-000ELF; Value: CR0603-J/-000ELF; Footprint: antmicro-footprints:R_0603_1608Metric
S4 S5 = SW_KMR211NGLFS_SMD: Manufacturer 1: C&K; License: Apache-2.0; Author: Antmicro; OldValue: SW_KMR211NGLFS_SMD; Manufacturer Part Number 1: KMR211NGLFS; Value: KMR211NGLFS; Footprint: antmicro-footprints:SW_KMR211NGLFS_SMD
SW1 = SW_SPDT_PCM12SMTR: Manufacturer 1: C&K; License: Apache-2.0; Author: Antmicro; OldValue: SW_SPDT_PCM12SMTR; Manufacturer Part Number 1: PCM12SMTR; Value: PCM12SMTR; Footprint: antmicro-footprints:PCM12SMTR
TP14 TP23 TP52-TP55 = TP_0.75mm_SMD: License: Apache-2.0; Author: Antmicro; OldValue: TP_0.75mm_SMD; Value: TP_0.75mm_SMD; Footprint: antmicro-footprints:TP_SMD_0.75mm
TP33 = TP_0.75mm_SMD_3: License: Apache-2.0; Author: Antmicro; OldValue: TP_0.75mm_SMD; Value: TP_0.75mm_SMD; Footprint: antmicro-footprints:TP_SMD_0.75mm
U1 = SIC431AED-T1-GE3_1: Manufacturer 1: Vishay; License: Apache-2.0; Author: Antmicro; OldValue: SIC431AED-T1-GE3; Manufacturer Part Number 1: SIC431AED-T1-GE3; Value: SIC431AED-T1-GE3; Footprint: antmicro-footprints:MLP44-24L_4x4x0.75mm
U29 U48 = LM73100: Manufacturer 1: Texas Instruments; License: Apache-2.0; Author: Antmicro; OldValue: LM73100; Manufacturer Part Number 1: LM73100RPWR; Value: LM73100RPWR; Footprint: antmicro-footprints:VQFN-HR-10_2x2mm
U37 = 74LVC2G14_SOT457: Manufacturer 1: Nexperia; License: Apache-2.0; Author: Antmicro; OldValue: 74LVC2G14_SOT457; Manufacturer Part Number 1: 74LVC2G14GV,125; Value: 74LVC2G14GV,125; Footprint: antmicro-footprints:SOT-23-6
U38 = 74LVC1G175_SOT457: Manufacturer 1: Nexperia; License: Apache-2.0; Author: Antmicro; OldValue: 74LVC1G175_SOT457; Manufacturer Part Number 1: 74LVC1G175GV,125; Value: 74LVC1G175GV,125; Footprint: antmicro-footprints:SOT-23-6
U40 = SIC431AED-T1-GE3: Manufacturer 1: Vishay; License: Apache-2.0; Author: Antmicro; OldValue: SIC431AED-T1-GE3; Manufacturer Part Number 1: SIC431AED-T1-GE3; Value: SIC431AED-T1-GE3; Footprint: antmicro-footprints:MLP44-24L_4x4x0.75mm
U41 = NCP730BMT330_WSON: Manufacturer 1: ON Semiconductor; License: Apache-2.0; Author: Antmicro; OldValue: NCP730BMT330_WSON; Manufacturer Part Number 1: NCP730BMT330TBG; Value: NCP730BMT330TBG; Footprint: antmicro-footprints:WSON-6-1EP_2x2mm_P0.65mm
U42 = TPS7A0518P_SOT23-5: Manufacturer 1: Texas Instruments; License: Apache-2.0; Author: Antmicro; OldValue: TPS7A0518P_SOT23-5; Manufacturer Part Number 1: TPS7A0518PDBVT; Value: TPS7A0518PDBVT; Footprint: antmicro-footprints:SOT-23-5
#FLG01 #FLG03 #FLG04 #FLG05 #FLG06 #FLG011 = PWR_FLAG: Value: PWR_FLAG

## Sheet som.SchDoc
size 420 x 297 mm
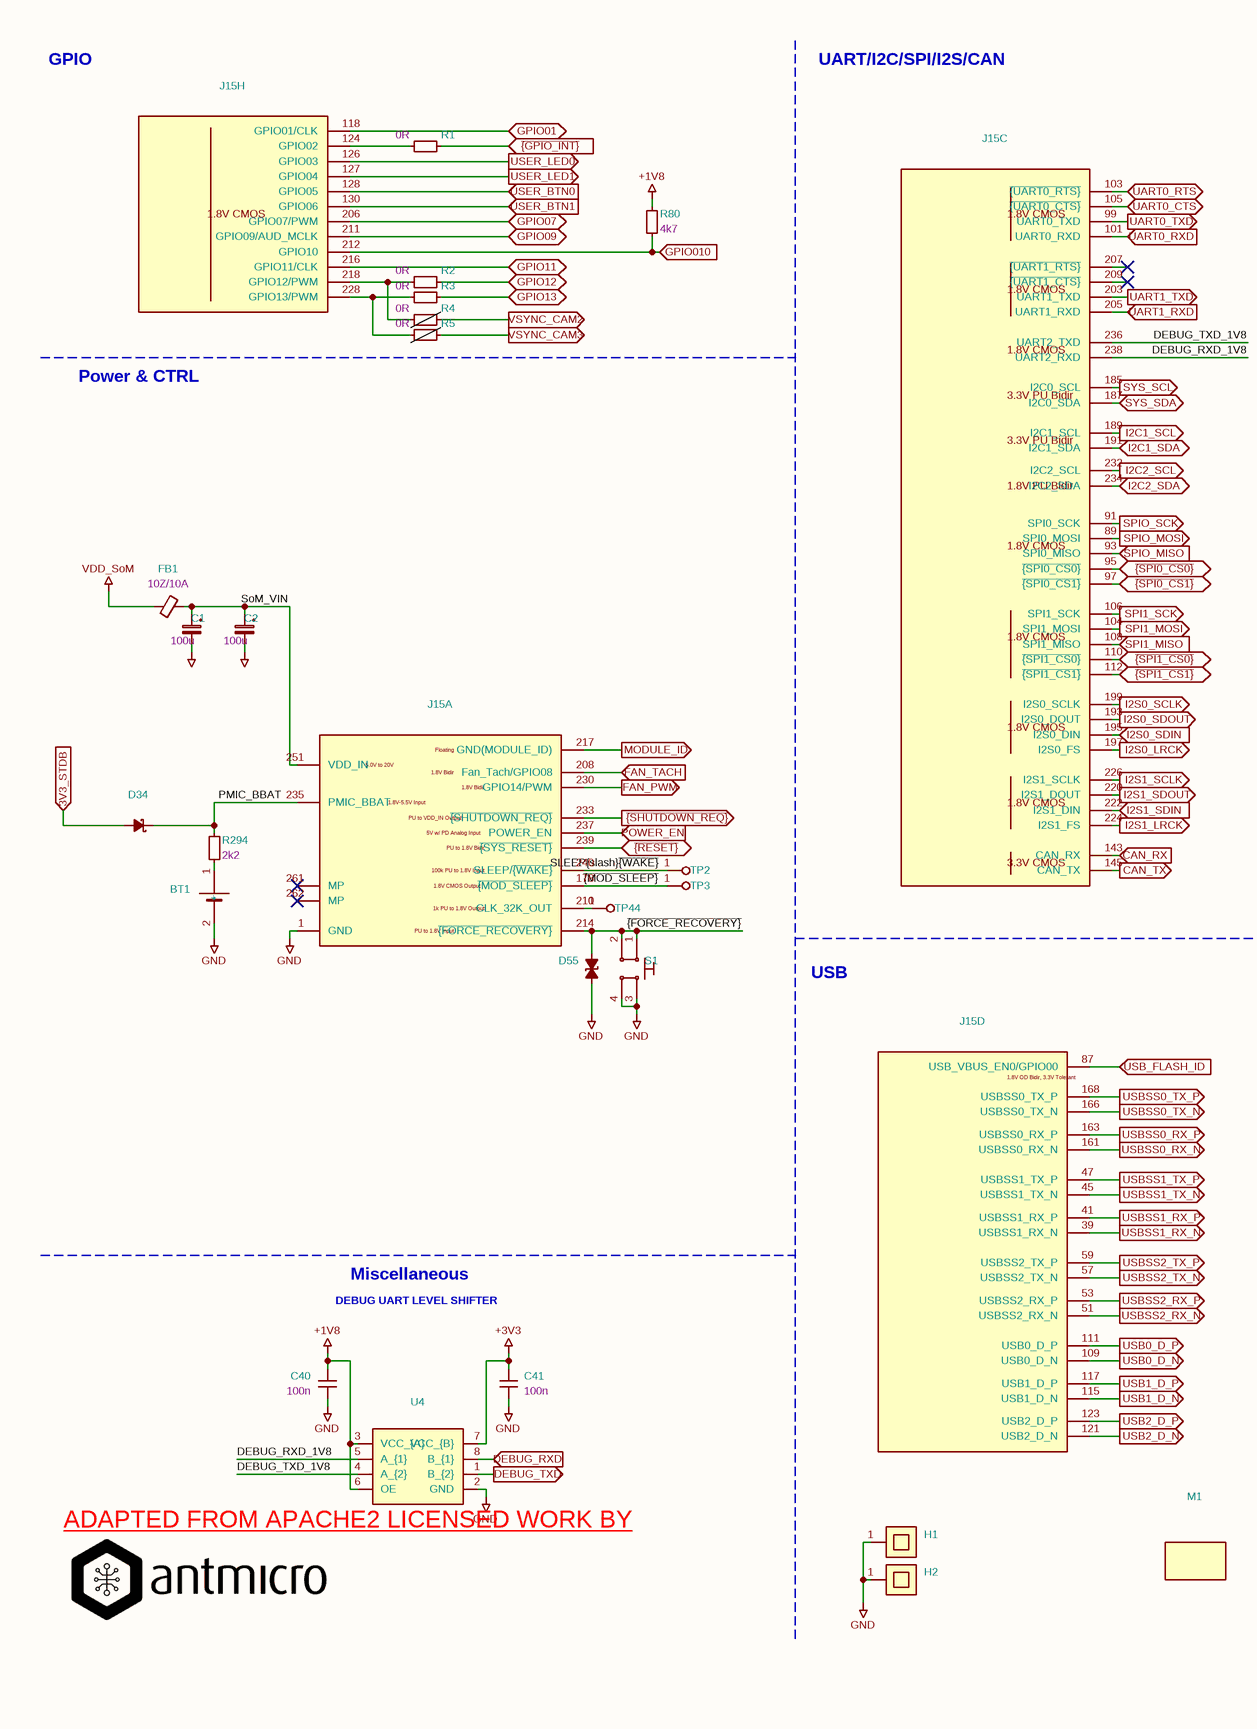
[diagram p5: som.SchDoc, left]
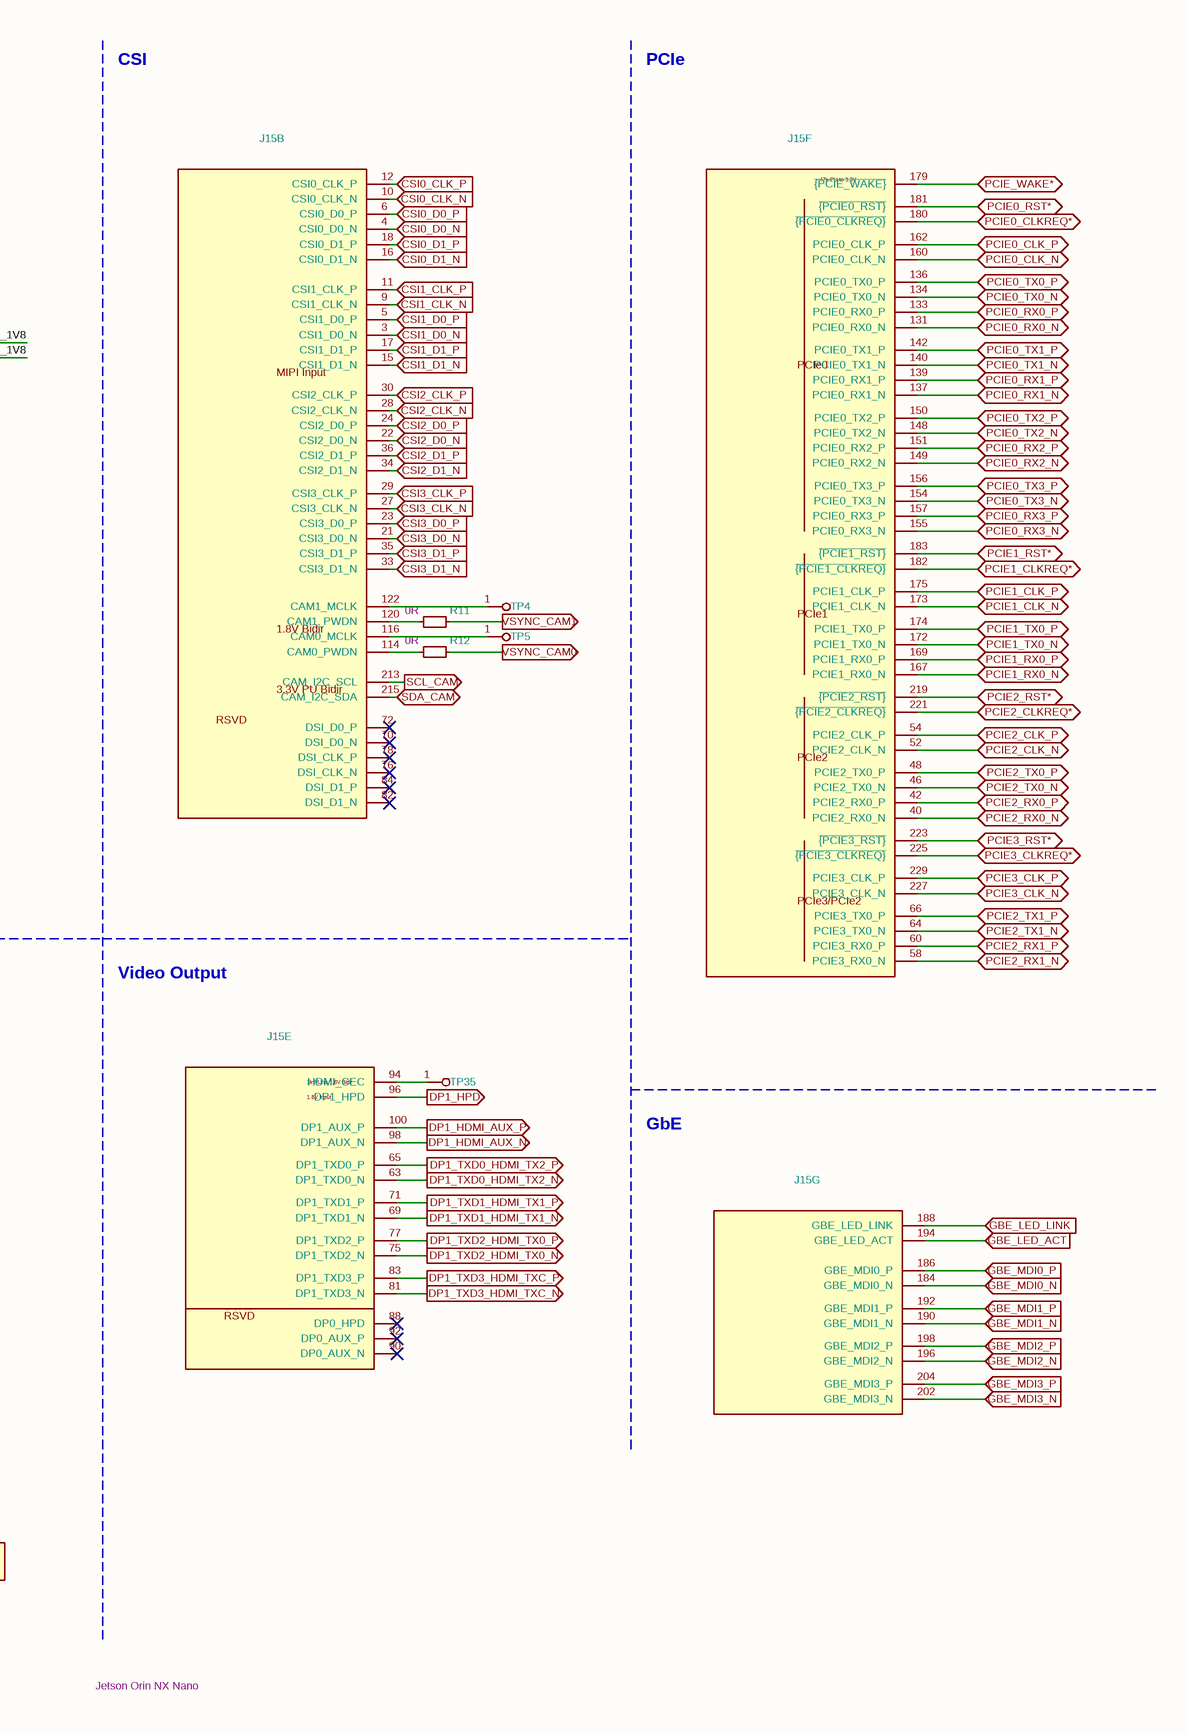
[diagram p6: som.SchDoc, right]

### Parts
BT1  MS621FE-FL11E  [MS621FE-FL11E]  (value not drawn)
C1  Val: 100u  [C_Pol_EIA-X]  (hidden comment: T521D107M025ATE040)
C2  Val: 100u  [C_Pol_EIA-X]  (hidden comment: T521D107M025ATE040)
C40  Val: 100n  [C_0402_1005Metric]  (hidden comment: GRM155R61H104KE14D)
C41  Val: 100n  [C_0402_1005Metric]  (hidden comment: GRM155R61H104KE14D)
D34  RB521S30T1G  [SOD-523]  (value not drawn)
D55  TPD1E0B04DPYR  [XDFN-2_1x0.60mm]  (value not drawn)
FB1  Val: 10Z/10A  [FB_1206_3216Metric]  (hidden comment: 74279221100)
H1  9774065151R  [Spacer_Drill3.7mm_H6.5mm_9774065151R]  (value not drawn)
H2  9774065151R  [Spacer_Drill3.7mm_H6.5mm_9774065151R]  (value not drawn)
J15  2309413-1  [TE_2309413]  (value not drawn)  (parts A,B,C,D,E,F,G,H of 8)
M1  Displayed name: Jetson Orin NX Nano  [Module_Jetson-Orin-NX-Nano]  (hidden comment: 900-13767-0000-000)  (mechanical)
R1  Val: 0R  [R_0402_1005Metric]  (hidden comment: ERJ2GE0R00X)
R2  Val: 0R  [R_0402_1005Metric]  (hidden comment: ERJ2GE0R00X)
R3  Val: 0R  [R_0402_1005Metric]  (hidden comment: ERJ2GE0R00X)
R4  Val: 0R  [R_0402_1005Metric]  (hidden comment: ERJ2GE0R00X)  (no BOM)
R5  Val: 0R  [R_0402_1005Metric]  (hidden comment: ERJ2GE0R00X)  (no BOM)
R11  Val: 0R  [R_0402_1005Metric]  (hidden comment: ERJ2GE0R00X)
R12  Val: 0R  [R_0402_1005Metric]  (hidden comment: ERJ2GE0R00X)
R80  Val: 4k7  [R_0402_1005Metric]  (hidden comment: CR0402-FX-4701GLF)
R294  Val: 2k2  [R_0402_1005Metric]  (hidden comment: CR0402-FX-2201GLF)
S1  KMR211NGLFS  [SW_KMR211NGLFS_SMD]  (value not drawn)
TP2  TP_0.75mm_SMD  [TP_SMD_0.75mm]  (value not drawn)  (no BOM)
TP3  TP_0.75mm_SMD  [TP_SMD_0.75mm]  (value not drawn)  (no BOM)
TP4  TP_0.75mm_SMD  [TP_SMD_0.75mm]  (value not drawn)  (no BOM)
TP5  TP_0.75mm_SMD  [TP_SMD_0.75mm]  (value not drawn)  (no BOM)
TP35  TP_0.75mm_SMD  [TP_SMD_0.75mm]  (value not drawn)  (no BOM)
TP44  TP_0.75mm_SMD  [TP_SMD_0.75mm]  (value not drawn)  (no BOM)
U4  NTS0102GT  [XSON-8_1x1.95mm_P0.5mm]  (value not drawn)

### Ports
3V3_STDB (in), CAN_RX (in), CAN_TX (out), CSI0_CLK_N (in), CSI0_CLK_P (in), CSI0_D0_N (in), CSI0_D0_P (in), CSI0_D1_N (in), CSI0_D1_P (in), CSI1_CLK_N (in), CSI1_CLK_P (in), CSI1_D0_N (in), CSI1_D0_P (in), CSI1_D1_N (in), CSI1_D1_P (in), CSI2_CLK_N (in), CSI2_CLK_P (in), CSI2_D0_N (in), CSI2_D0_P (in), CSI2_D1_N (in), CSI2_D1_P (in), CSI3_CLK_N (in), CSI3_CLK_P (in), CSI3_D0_N (in), CSI3_D0_P (in), CSI3_D1_N (in), CSI3_D1_P (in), DEBUG_RXD (in), DEBUG_TXD (out), DP1_HDMI_AUX_N (out), DP1_HDMI_AUX_P (out), DP1_HPD (out), DP1_TXD0_HDMI_TX2_N (out), DP1_TXD0_HDMI_TX2_P (out), DP1_TXD1_HDMI_TX1_N (out), DP1_TXD1_HDMI_TX1_P (out), DP1_TXD2_HDMI_TX0_N (out), DP1_TXD2_HDMI_TX0_P (out), DP1_TXD3_HDMI_TXC_N (out), DP1_TXD3_HDMI_TXC_P (out), FAN_PWM (out), FAN_TACH (in), GBE_LED_ACT (in), GBE_LED_LINK (in), GBE_MDI0_N (in), GBE_MDI0_P (in), GBE_MDI1_N (in), GBE_MDI1_P (in), GBE_MDI2_N (in), GBE_MDI2_P (in), GBE_MDI3_N (in), GBE_MDI3_P (in), GPIO01 (bidir), GPIO07 (bidir), GPIO09 (bidir), GPIO010 (in), GPIO11 (bidir), GPIO12 (bidir), GPIO13 (bidir), I2C1_SCL (out), I2C1_SDA (bidir), I2C2_SCL (out), I2C2_SDA (bidir), I2S0_LRCK (out), I2S0_SCLK (out), I2S0_SDIN (in), I2S0_SDOUT (out), I2S1_LRCK (out), I2S1_SCLK (out), I2S1_SDIN (in), I2S1_SDOUT (out), MODULE_ID (out), PCIE0_CLK_N (bidir), PCIE0_CLK_P (bidir), PCIE0_CLKREQ* (bidir), PCIE0_RST* (bidir), PCIE0_RX0_N (bidir), PCIE0_RX0_P (bidir), PCIE0_RX1_N (bidir), PCIE0_RX1_P (bidir), PCIE0_RX2_N (bidir), PCIE0_RX2_P (bidir), PCIE0_RX3_N (bidir), PCIE0_RX3_P (bidir), PCIE0_TX0_N (bidir), PCIE0_TX0_P (bidir), PCIE0_TX1_N (bidir), PCIE0_TX1_P (bidir), PCIE0_TX2_N (bidir), PCIE0_TX2_P (bidir), PCIE0_TX3_N (bidir), PCIE0_TX3_P (bidir), PCIE1_CLK_N (bidir), PCIE1_CLK_P (bidir), PCIE1_CLKREQ* (bidir), PCIE1_RST* (bidir), PCIE1_RX0_N (bidir), PCIE1_RX0_P (bidir), PCIE1_TX0_N (bidir), PCIE1_TX0_P (bidir), PCIE2_CLK_N (bidir), PCIE2_CLK_P (bidir), PCIE2_CLKREQ* (bidir), PCIE2_RST* (bidir), PCIE2_RX0_N (bidir), PCIE2_RX0_P (bidir), PCIE2_RX1_N (bidir), PCIE2_RX1_P (bidir), PCIE2_TX0_N (bidir), PCIE2_TX0_P (bidir), PCIE2_TX1_N (bidir), PCIE2_TX1_P (bidir), PCIE3_CLK_N (bidir), PCIE3_CLK_P (bidir), PCIE3_CLKREQ* (bidir), PCIE3_RST* (bidir), PCIE_WAKE* (bidir), POWER_EN (in), SCL_CAM (out), SDA_CAM (bidir), SPI1_MISO (in), SPI1_MOSI (out), SPI1_SCK (out), SPIO_MISO (in), SPIO_MOSI (out), SPIO_SCK (out), SYS_SCL (out), SYS_SDA (bidir), UART0_CTS (bidir), UART0_RTS (bidir), UART0_RXD (in), UART0_TXD (out), UART1_RXD (in), UART1_TXD (out), USB0_D_N (out), USB0_D_P (out), USB1_D_N (out), USB1_D_P (out), USB2_D_N (out), USB2_D_P (out), USB_FLASH_ID (in), USBSS0_RX_N (out), USBSS0_RX_P (out), USBSS0_TX_N (out), USBSS0_TX_P (out), USBSS1_RX_N (out), USBSS1_RX_P (out), USBSS1_TX_N (out), USBSS1_TX_P (out), USBSS2_RX_N (out), USBSS2_RX_P (out), USBSS2_TX_N (out), USBSS2_TX_P (out), USER_BTN0 (in), USER_BTN1 (in), USER_LED0 (out), USER_LED1 (out), VSYNC_CAM0 (out), VSYNC_CAM1 (out), VSYNC_CAM2 (out), VSYNC_CAM3 (out), ~{{GPIO_INT}} (in), ~{{RESET}} (bidir), ~{{SHUTDOWN_REQ}} (out), ~{{SPI0_CS0}} (bidir), ~{{SPI0_CS1}} (bidir), ~{{SPI1_CS0}} (bidir), ~{{SPI1_CS1}} (bidir)

### Nets
+1V8: C40.2 R80.2 U4.3(VCC_{A}) U4.6(OE)
+3V3: C41.2 U4.7(VCC_{B})
GND: BT1.2(-) C1.2 C2.2 C40.1 C41.1 D55.1(C) H1.1 H2.1 J15.1(GND) S1.3 S1.4 U4.2(GND)
VDD_SoM: FB1.1
3V3_STDB: D34.2(A) ; port 3V3_STDB
CAN_RX: J15.143(CAN_RX) ; port CAN_RX
CAN_TX: J15.145(CAN_TX) ; port CAN_TX
CSI0_CLK_N: J15.10(CSI0_CLK_N) ; port CSI0_CLK_N
CSI0_CLK_P: J15.12(CSI0_CLK_P) ; port CSI0_CLK_P
CSI0_D0_N: J15.4(CSI0_D0_N) ; port CSI0_D0_N
CSI0_D0_P: J15.6(CSI0_D0_P) ; port CSI0_D0_P
CSI0_D1_N: J15.16(CSI0_D1_N) ; port CSI0_D1_N
CSI0_D1_P: J15.18(CSI0_D1_P) ; port CSI0_D1_P
CSI1_CLK_N: J15.9(CSI1_CLK_N) ; port CSI1_CLK_N
CSI1_CLK_P: J15.11(CSI1_CLK_P) ; port CSI1_CLK_P
CSI1_D0_N: J15.3(CSI1_D0_N) ; port CSI1_D0_N
CSI1_D0_P: J15.5(CSI1_D0_P) ; port CSI1_D0_P
CSI1_D1_N: J15.15(CSI1_D1_N) ; port CSI1_D1_N
CSI1_D1_P: J15.17(CSI1_D1_P) ; port CSI1_D1_P
CSI2_CLK_N: J15.28(CSI2_CLK_N) ; port CSI2_CLK_N
CSI2_CLK_P: J15.30(CSI2_CLK_P) ; port CSI2_CLK_P
CSI2_D0_N: J15.22(CSI2_D0_N) ; port CSI2_D0_N
CSI2_D0_P: J15.24(CSI2_D0_P) ; port CSI2_D0_P
CSI2_D1_N: J15.34(CSI2_D1_N) ; port CSI2_D1_N
CSI2_D1_P: J15.36(CSI2_D1_P) ; port CSI2_D1_P
CSI3_CLK_N: J15.27(CSI3_CLK_N) ; port CSI3_CLK_N
CSI3_CLK_P: J15.29(CSI3_CLK_P) ; port CSI3_CLK_P
CSI3_D0_N: J15.21(CSI3_D0_N) ; port CSI3_D0_N
CSI3_D0_P: J15.23(CSI3_D0_P) ; port CSI3_D0_P
CSI3_D1_N: J15.33(CSI3_D1_N) ; port CSI3_D1_N
CSI3_D1_P: J15.35(CSI3_D1_P) ; port CSI3_D1_P
DEBUG_RXD: U4.8(B_{1}) ; port DEBUG_RXD
DEBUG_RXD_1V8: J15.238(UART2_RXD) U4.5(A_{1})
DEBUG_TXD: U4.1(B_{2}) ; port DEBUG_TXD
DEBUG_TXD_1V8: J15.236(UART2_TXD) U4.4(A_{2})
DP1_HDMI_AUX_N: J15.98(DP1_AUX_N) ; port DP1_HDMI_AUX_N
DP1_HDMI_AUX_P: J15.100(DP1_AUX_P) ; port DP1_HDMI_AUX_P
DP1_HPD: J15.96(DP1_HPD) ; port DP1_HPD
DP1_TXD0_HDMI_TX2_N: J15.63(DP1_TXD0_N) ; port DP1_TXD0_HDMI_TX2_N
DP1_TXD0_HDMI_TX2_P: J15.65(DP1_TXD0_P) ; port DP1_TXD0_HDMI_TX2_P
DP1_TXD1_HDMI_TX1_N: J15.69(DP1_TXD1_N) ; port DP1_TXD1_HDMI_TX1_N
DP1_TXD1_HDMI_TX1_P: J15.71(DP1_TXD1_P) ; port DP1_TXD1_HDMI_TX1_P
DP1_TXD2_HDMI_TX0_N: J15.75(DP1_TXD2_N) ; port DP1_TXD2_HDMI_TX0_N
DP1_TXD2_HDMI_TX0_P: J15.77(DP1_TXD2_P) ; port DP1_TXD2_HDMI_TX0_P
DP1_TXD3_HDMI_TXC_N: J15.81(DP1_TXD3_N) ; port DP1_TXD3_HDMI_TXC_N
DP1_TXD3_HDMI_TXC_P: J15.83(DP1_TXD3_P) ; port DP1_TXD3_HDMI_TXC_P
FAN_PWM: J15.230(GPIO14/PWM) ; port FAN_PWM
FAN_TACH: J15.208(Fan_Tach/GPIO08) ; port FAN_TACH
GBE_LED_ACT: J15.194(GBE_LED_ACT) ; port GBE_LED_ACT
GBE_LED_LINK: J15.188(GBE_LED_LINK) ; port GBE_LED_LINK
GBE_MDI0_N: J15.184(GBE_MDI0_N) ; port GBE_MDI0_N
GBE_MDI0_P: J15.186(GBE_MDI0_P) ; port GBE_MDI0_P
GBE_MDI1_N: J15.190(GBE_MDI1_N) ; port GBE_MDI1_N
GBE_MDI1_P: J15.192(GBE_MDI1_P) ; port GBE_MDI1_P
GBE_MDI2_N: J15.196(GBE_MDI2_N) ; port GBE_MDI2_N
GBE_MDI2_P: J15.198(GBE_MDI2_P) ; port GBE_MDI2_P
GBE_MDI3_N: J15.202(GBE_MDI3_N) ; port GBE_MDI3_N
GBE_MDI3_P: J15.204(GBE_MDI3_P) ; port GBE_MDI3_P
GPIO01: J15.118(GPIO01/CLK) ; port GPIO01
GPIO07: J15.206(GPIO07/PWM) ; port GPIO07
GPIO09: J15.211(GPIO09/AUD_MCLK) ; port GPIO09
GPIO010: J15.212(GPIO10) R80.1 ; port GPIO010
GPIO11: J15.216(GPIO11/CLK) ; port GPIO11
GPIO12: R2.2 ; port GPIO12
GPIO13: R3.2 ; port GPIO13
I2C1_SCL: J15.189(I2C1_SCL) ; port I2C1_SCL
I2C1_SDA: J15.191(I2C1_SDA) ; port I2C1_SDA
I2C2_SCL: J15.232(I2C2_SCL) ; port I2C2_SCL
I2C2_SDA: J15.234(I2C2_SDA) ; port I2C2_SDA
I2S0_LRCK: J15.197(I2S0_FS) ; port I2S0_LRCK
I2S0_SCLK: J15.199(I2S0_SCLK) ; port I2S0_SCLK
I2S0_SDIN: J15.195(I2S0_DIN) ; port I2S0_SDIN
I2S0_SDOUT: J15.193(I2S0_DOUT) ; port I2S0_SDOUT
I2S1_LRCK: J15.224(I2S1_FS) ; port I2S1_LRCK
I2S1_SCLK: J15.226(I2S1_SCLK) ; port I2S1_SCLK
I2S1_SDIN: J15.222(I2S1_DIN) ; port I2S1_SDIN
I2S1_SDOUT: J15.220(I2S1_DOUT) ; port I2S1_SDOUT
MODULE_ID: J15.217(GND(MODULE_ID)) ; port MODULE_ID
PCIE0_CLK_N: J15.160(PCIE0_CLK_N) ; port PCIE0_CLK_N
PCIE0_CLK_P: J15.162(PCIE0_CLK_P) ; port PCIE0_CLK_P
PCIE0_CLKREQ*: J15.180(~{{PCIE0_CLKREQ}}) ; port PCIE0_CLKREQ*
PCIE0_RST*: J15.181(~{{PCIE0_RST}}) ; port PCIE0_RST*
PCIE0_RX0_N: J15.131(PCIE0_RX0_N) ; port PCIE0_RX0_N
PCIE0_RX0_P: J15.133(PCIE0_RX0_P) ; port PCIE0_RX0_P
PCIE0_RX1_N: J15.137(PCIE0_RX1_N) ; port PCIE0_RX1_N
PCIE0_RX1_P: J15.139(PCIE0_RX1_P) ; port PCIE0_RX1_P
PCIE0_RX2_N: J15.149(PCIE0_RX2_N) ; port PCIE0_RX2_N
PCIE0_RX2_P: J15.151(PCIE0_RX2_P) ; port PCIE0_RX2_P
PCIE0_RX3_N: J15.155(PCIE0_RX3_N) ; port PCIE0_RX3_N
PCIE0_RX3_P: J15.157(PCIE0_RX3_P) ; port PCIE0_RX3_P
PCIE0_TX0_N: J15.134(PCIE0_TX0_N) ; port PCIE0_TX0_N
PCIE0_TX0_P: J15.136(PCIE0_TX0_P) ; port PCIE0_TX0_P
PCIE0_TX1_N: J15.140(PCIE0_TX1_N) ; port PCIE0_TX1_N
PCIE0_TX1_P: J15.142(PCIE0_TX1_P) ; port PCIE0_TX1_P
PCIE0_TX2_N: J15.148(PCIE0_TX2_N) ; port PCIE0_TX2_N
PCIE0_TX2_P: J15.150(PCIE0_TX2_P) ; port PCIE0_TX2_P
PCIE0_TX3_N: J15.154(PCIE0_TX3_N) ; port PCIE0_TX3_N
PCIE0_TX3_P: J15.156(PCIE0_TX3_P) ; port PCIE0_TX3_P
PCIE1_CLK_N: J15.173(PCIE1_CLK_N) ; port PCIE1_CLK_N
PCIE1_CLK_P: J15.175(PCIE1_CLK_P) ; port PCIE1_CLK_P
PCIE1_CLKREQ*: J15.182(~{{PCIE1_CLKREQ}}) ; port PCIE1_CLKREQ*
PCIE1_RST*: J15.183(~{{PCIE1_RST}}) ; port PCIE1_RST*
PCIE1_RX0_N: J15.167(PCIE1_RX0_N) ; port PCIE1_RX0_N
PCIE1_RX0_P: J15.169(PCIE1_RX0_P) ; port PCIE1_RX0_P
PCIE1_TX0_N: J15.172(PCIE1_TX0_N) ; port PCIE1_TX0_N
PCIE1_TX0_P: J15.174(PCIE1_TX0_P) ; port PCIE1_TX0_P
PCIE2_CLK_N: J15.52(PCIE2_CLK_N) ; port PCIE2_CLK_N
PCIE2_CLK_P: J15.54(PCIE2_CLK_P) ; port PCIE2_CLK_P
PCIE2_CLKREQ*: J15.221(~{{PCIE2_CLKREQ}}) ; port PCIE2_CLKREQ*
PCIE2_RST*: J15.219(~{{PCIE2_RST}}) ; port PCIE2_RST*
PCIE2_RX0_N: J15.40(PCIE2_RX0_N) ; port PCIE2_RX0_N
PCIE2_RX0_P: J15.42(PCIE2_RX0_P) ; port PCIE2_RX0_P
PCIE2_RX1_N: J15.58(PCIE3_RX0_N) ; port PCIE2_RX1_N
PCIE2_RX1_P: J15.60(PCIE3_RX0_P) ; port PCIE2_RX1_P
PCIE2_TX0_N: J15.46(PCIE2_TX0_N) ; port PCIE2_TX0_N
PCIE2_TX0_P: J15.48(PCIE2_TX0_P) ; port PCIE2_TX0_P
PCIE2_TX1_N: J15.64(PCIE3_TX0_N) ; port PCIE2_TX1_N
PCIE2_TX1_P: J15.66(PCIE3_TX0_P) ; port PCIE2_TX1_P
PCIE3_CLK_N: J15.227(PCIE3_CLK_N) ; port PCIE3_CLK_N
PCIE3_CLK_P: J15.229(PCIE3_CLK_P) ; port PCIE3_CLK_P
PCIE3_CLKREQ*: J15.225(~{{PCIE3_CLKREQ}}) ; port PCIE3_CLKREQ*
PCIE3_RST*: J15.223(~{{PCIE3_RST}}) ; port PCIE3_RST*
PCIE_WAKE*: J15.179(~{{PCIE_WAKE}}) ; port PCIE_WAKE*
PMIC_BBAT: D34.1(C) J15.235(PMIC_BBAT) R294.2
POWER_EN: J15.237(POWER_EN) ; port POWER_EN
SCL_CAM: J15.213(CAM_I2C_SCL) ; port SCL_CAM
SDA_CAM: J15.215(CAM_I2C_SDA) ; port SDA_CAM
SLEEP{slash}~{{WAKE}}: J15.240(SLEEP/~{{WAKE}}) TP2.1
SoM_VIN: C1.1 C2.1 FB1.2 J15.251(VDD_IN)
SPI1_MISO: J15.108(SPI1_MISO) ; port SPI1_MISO
SPI1_MOSI: J15.104(SPI1_MOSI) ; port SPI1_MOSI
SPI1_SCK: J15.106(SPI1_SCK) ; port SPI1_SCK
SPIO_MISO: J15.93(SPI0_MISO) ; port SPIO_MISO
SPIO_MOSI: J15.89(SPI0_MOSI) ; port SPIO_MOSI
SPIO_SCK: J15.91(SPI0_SCK) ; port SPIO_SCK
SYS_SCL: J15.185(I2C0_SCL) ; port SYS_SCL
SYS_SDA: J15.187(I2C0_SDA) ; port SYS_SDA
UART0_CTS: J15.105(~{{UART0_CTS}}) ; port UART0_CTS
UART0_RTS: J15.103(~{{UART0_RTS}}) ; port UART0_RTS
UART0_RXD: J15.101(UART0_RXD) ; port UART0_RXD
UART0_TXD: J15.99(UART0_TXD) ; port UART0_TXD
UART1_RXD: J15.205(UART1_RXD) ; port UART1_RXD
UART1_TXD: J15.203(UART1_TXD) ; port UART1_TXD
USB0_D_N: J15.109(USB0_D_N) ; port USB0_D_N
USB0_D_P: J15.111(USB0_D_P) ; port USB0_D_P
USB1_D_N: J15.115(USB1_D_N) ; port USB1_D_N
USB1_D_P: J15.117(USB1_D_P) ; port USB1_D_P
USB2_D_N: J15.121(USB2_D_N) ; port USB2_D_N
USB2_D_P: J15.123(USB2_D_P) ; port USB2_D_P
USB_FLASH_ID: J15.87(USB_VBUS_EN0/GPIO00) ; port USB_FLASH_ID
USBSS0_RX_N: J15.161(USBSS0_RX_N) ; port USBSS0_RX_N
USBSS0_RX_P: J15.163(USBSS0_RX_P) ; port USBSS0_RX_P
USBSS0_TX_N: J15.166(USBSS0_TX_N) ; port USBSS0_TX_N
USBSS0_TX_P: J15.168(USBSS0_TX_P) ; port USBSS0_TX_P
USBSS1_RX_N: J15.39(USBSS1_RX_N) ; port USBSS1_RX_N
USBSS1_RX_P: J15.41(USBSS1_RX_P) ; port USBSS1_RX_P
USBSS1_TX_N: J15.45(USBSS1_TX_N) ; port USBSS1_TX_N
USBSS1_TX_P: J15.47(USBSS1_TX_P) ; port USBSS1_TX_P
USBSS2_RX_N: J15.51(USBSS2_RX_N) ; port USBSS2_RX_N
USBSS2_RX_P: J15.53(USBSS2_RX_P) ; port USBSS2_RX_P
USBSS2_TX_N: J15.57(USBSS2_TX_N) ; port USBSS2_TX_N
USBSS2_TX_P: J15.59(USBSS2_TX_P) ; port USBSS2_TX_P
USER_BTN0: J15.128(GPIO05) ; port USER_BTN0
USER_BTN1: J15.130(GPIO06) ; port USER_BTN1
USER_LED0: J15.126(GPIO03) ; port USER_LED0
USER_LED1: J15.127(GPIO04) ; port USER_LED1
VSYNC_CAM0: R12.2 ; port VSYNC_CAM0
VSYNC_CAM1: R11.2 ; port VSYNC_CAM1
VSYNC_CAM2: R4.2 ; port VSYNC_CAM2
VSYNC_CAM3: R5.2 ; port VSYNC_CAM3
~{{FORCE_RECOVERY}}: D55.2(A) J15.214(~{{FORCE_RECOVERY}}) S1.1 S1.2
~{{GPIO_INT}}: R1.2 ; port ~{{GPIO_INT}}
~{{MOD_SLEEP}}: J15.178(~{{MOD_SLEEP}}) TP3.1
~{{RESET}}: J15.239(~{{SYS_RESET}}) ; port ~{{RESET}}
~{{SHUTDOWN_REQ}}: J15.233(~{{SHUTDOWN_REQ}}) ; port ~{{SHUTDOWN_REQ}}
~{{SPI0_CS0}}: J15.95(~{{SPI0_CS0}}) ; port ~{{SPI0_CS0}}
~{{SPI0_CS1}}: J15.97(~{{SPI0_CS1}}) ; port ~{{SPI0_CS1}}
~{{SPI1_CS0}}: J15.110(~{{SPI1_CS0}}) ; port ~{{SPI1_CS0}}
~{{SPI1_CS1}}: J15.112(~{{SPI1_CS1}}) ; port ~{{SPI1_CS1}}
NetBT1_1: BT1.1(+) R294.1
NetJ15_94: J15.94(HDMI_CEC) TP35.1
NetJ15_114: J15.114(CAM0_PWDN) R12.1
NetJ15_116: J15.116(CAM0_MCLK) TP5.1
NetJ15_120: J15.120(CAM1_PWDN) R11.1
NetJ15_122: J15.122(CAM1_MCLK) TP4.1
NetJ15_124: J15.124(GPIO02) R1.1
NetJ15_210: J15.210(CLK_32K_OUT) TP44.1
NetJ15_218: J15.218(GPIO12/PWM) R2.1 R4.1
NetJ15_228: J15.228(GPIO13/PWM) R3.1 R5.1

Not connected (* = marked no-connect by the designer): J15 2(GND) 7(GND) 8(GND) 13(GND) 14(GND) 19(GND) 20(GND) 25(GND) 26(GND) 31(GND) 32(GND) 37(GND) 38(GND) 43(GND) 44(GND) 49(GND) 50(GND) 55(GND) 56(GND) 61(GND) 62(GND) 67(GND) 68(GND) 70(DSI_D0_N)* 72(DSI_D0_P)* 73(GND) 74(GND) 76(DSI_CLK_N)* 78(DSI_CLK_P)* 79(GND) 80(GND) 82(DSI_D1_N)* 84(DSI_D1_P)* 85(GND) 86(GND) 88(DP0_HPD)* 90(DP0_AUX_N)* 92(DP0_AUX_P)* 102(GND) 107(GND) 113(GND) 119(GND) 125(GND) 129(GND) 132(GND) 135(GND) 138(GND) 141(GND) 144(GND) 146(GND) 147(GND) 152(GND) 153(GND) 158(GND) 159(GND) 164(GND) 165(GND) 170(GND) 171(GND) 176(GND) 177(GND) 200(GND) 201(GND) 207(~{{UART1_RTS}})* 209(~{{UART1_CTS}})* 231(GND) 241(GND) 242(GND) 243(GND) 244(GND) 245(GND) 246(GND) 247(GND) 248(GND) 249(GND) 250(GND) 252(VDD_IN) 253(VDD_IN) 254(VDD_IN) 255(VDD_IN) 256(VDD_IN) 257(VDD_IN) 258(VDD_IN) 259(VDD_IN) 260(VDD_IN) 261(MP)* 262(MP)*

### Notes on the sheet
- GPIO
- UART/I2C/SPI/I2S/CAN
- CSI
- PCIe
- Power & CTRL
- USB
- Video Output
- GbE
- DEBUG UART LEVEL SHIFTER
- Miscellaneous
- (near U4) ADAPTED FROM APACHE2 LICENSED WORK BY <https://github.com/antmicro/jetson-orin-baseboard>
- 1
- 2
- 3
- 4
- 5
- 6
- 7
- 8
- A
- B
- C
- D
- E
- www.antmicro.com <http://www.antmicro.com>
- Title: Jetson Orin Baseboard
- File: som.kicad_sch
- Sheet: /
- Antmicro Ltd
- F
- KiCad E.D.A.  kicad (5.1.4)-1
- Size: A3
- Date: 2025-01-15
- Rev: 1.3.0
- Id: 1/1
- (in symbol Bus_DDR4_SODIMM_CUSTOM_Jetson-Orin-H9.2mm-socket, part A) Floating; 5.0V to 20V; 1.8V Bidir; 1.8V-5.5V Input; PU to VDD_IN Output; 5V w/ PD Analog Input; PU to 1.8V Bidir; 100k PU to 1.8V Input; 1.8V CMOS Output; 1k PU to 1.8V Output; PU to 1.8V Input
- (in symbol Bus_DDR4_SODIMM_CUSTOM_Jetson-Orin-H9.2mm-socket, part B) MIPI Input; 1.8V Bidir; 3.3V PU Bidir; RSVD
- (in symbol Bus_DDR4_SODIMM_CUSTOM_Jetson-Orin-H9.2mm-socket, part C) 1.8V CMOS; 3.3V PU Bidir; 1.8V PU Bidir; 3.3V CMOS
- (in symbol Bus_DDR4_SODIMM_CUSTOM_Jetson-Orin-H9.2mm-socket, part D) 1.8V OD Bidir, 3.3V Tolerant
- (in symbol Bus_DDR4_SODIMM_CUSTOM_Jetson-Orin-H9.2mm-socket, part E) 1k PU to 1.8V Bidir; 1.8V Input; RSVD
- (in symbol Bus_DDR4_SODIMM_CUSTOM_Jetson-Orin-H9.2mm-socket, part F) 47k PU to 3.3V; PCIe0; PCIe1; PCIe2; PCIe3/PCIe2
- (in symbol Bus_DDR4_SODIMM_CUSTOM_Jetson-Orin-H9.2mm-socket, part H) 1.8V CMOS

### Library data of the parts
BT1 = Battery_Holder_MS621FE-FL11E: Manufacturer 1: Seiko Instruments; License: Apache-2.0; Author: Antmicro; OldValue: Battery_Holder_MS621FE-FL11E; Manufacturer Part Number 1: MS621FE-FL11E; Value: MS621FE-FL11E; Footprint: antmicro-footprints:MS621FE-FL11E
C1 C2 = C_Pol_100u_25V_KEMET-T521-D-107: Manufacturer 1: KEMET; License: Apache-2.0; Voltage: 25V; Dielectric: template_dielectric; Author: Antmicro; OldValue: C_Pol_100u_25V_KEMET-T521-D-107; Manufacturer Part Number 1: T521D107M025ATE040; Value: T521D107M025ATE040; Footprint: antmicro-footprints:C_Pol_EIA-X
C40 C41 = C_100n_0402: Manufacturer 1: Murata; License: Apache-2.0; Voltage: 50V; Dielectric: X5R; Author: Antmicro; OldValue: C_100n_0402; Manufacturer Part Number 1: GRM155R61H104KE14D; Value: GRM155R61H104KE14D; Footprint: antmicro-footprints:C_0402_1005Metric
D34 = RB521S30T1G: Manufacturer 1: ON Semiconductor; License: Apache-2.0; Author: Antmicro; OldValue: RB521S30T1G; Manufacturer Part Number 1: RB521S30T1G; Value: RB521S30T1G; Footprint: antmicro-footprints:SOD-523
D55 = TPD1E0B04_XDFN-2: Manufacturer 1: Texas Instruments; License: Apache-2.0; Author: Antmicro; OldValue: TPD1E0B04_XDFN-2; Manufacturer Part Number 1: TPD1E0B04DPYR; Value: TPD1E0B04DPYR; Footprint: antmicro-footprints:XDFN-2_1x0.60mm
FB1 = FB_10Z_10A_WE-MPSB_1206: Manufacturer 1: Würth Elektronik; License: Apache-2.0; Author: Antmicro; OldValue: FB_10Z_10A_WE-MPSB_1206; Manufacturer Part Number 1: 74279221100; Value: 74279221100; Footprint: antmicro-footprints:FB_1206_3216Metric
H1 H2 = Spacer_Drill3.7mm_H6.5mm_9774065151R: Manufacturer 1: Würth Elektronik; License: Apache-2.0; Author: Antmicro; OldValue: Spacer_Drill3.7mm_H6.5mm_9774065151R; Manufacturer Part Number 1: 9774065151R; Value: 9774065151R; Footprint: antmicro-footprints:Spacer_Drill3.7mm_H6.5mm_9774065151R
J15 = Bus_DDR4_SODIMM_CUSTOM_Jetson-Orin-H9.2mm-socket: Manufacturer 1: TE Connectivity; License: Apache-2.0; Author: Antmicro; OldValue: Bus_DDR4_SODIMM_CUSTOM_Jetson-Orin-H9.2mm-socket; Manufacturer Part Number 1: 2309413-1; Value: 2309413-1; Footprint: antmicro-footprints:TE_2309413
M1 = Jetson-Orin-NX-Nano: Manufacturer 1: Nvidia; License: Apache-2.0; Author: Antmicro; OldValue: Jetson-Orin-NX-Nano; Manufacturer Part Number 1: 900-13767-0000-000; Value: 900-13767-0000-000; Footprint: antmicro-footprints:Module_Jetson-Orin-NX-Nano
R1-R5 R11 R12 = R_0R_0402: Manufacturer 1: Panasonic; License: Apache-2.0; Tolerance: ~; Current: 1A; Author: Antmicro; OldValue: R_0R_0402; Manufacturer Part Number 1: ERJ2GE0R00X; Value: ERJ2GE0R00X; Footprint: antmicro-footprints:R_0402_1005Metric
R80 = R_4k7_0402: Manufacturer 1: Bourns; License: Apache-2.0; Tolerance: 1%; Author: Antmicro; OldValue: R_4k7_0402; Manufacturer Part Number 1: CR0402-FX-4701GLF; Value: CR0402-FX-4701GLF; Footprint: antmicro-footprints:R_0402_1005Metric
R294 = R_2k2_0402: Manufacturer 1: Bourns; License: Apache-2.0; Tolerance: 1%; Author: Antmicro; OldValue: R_2k2_0402; Manufacturer Part Number 1: CR0402-FX-2201GLF; Value: CR0402-FX-2201GLF; Footprint: antmicro-footprints:R_0402_1005Metric
S1 = SW_KMR211NGLFS_SMD: Manufacturer 1: C&K; License: Apache-2.0; Author: Antmicro; OldValue: SW_KMR211NGLFS_SMD; Manufacturer Part Number 1: KMR211NGLFS; Value: KMR211NGLFS; Footprint: antmicro-footprints:SW_KMR211NGLFS_SMD
TP2 = TP_0.75mm_SMD_3: License: Apache-2.0; Author: Antmicro; OldValue: TP_0.75mm_SMD; Value: TP_0.75mm_SMD; Footprint: antmicro-footprints:TP_SMD_0.75mm
TP3 = TP_0.75mm_SMD_1: License: Apache-2.0; Author: Antmicro; OldValue: TP_0.75mm_SMD; Value: TP_0.75mm_SMD; Footprint: antmicro-footprints:TP_SMD_0.75mm
TP4 = TP_0.75mm_SMD_5: License: Apache-2.0; Author: Antmicro; OldValue: TP_0.75mm_SMD; Value: TP_0.75mm_SMD; Footprint: antmicro-footprints:TP_SMD_0.75mm
TP5 = TP_0.75mm_SMD_4: License: Apache-2.0; Author: Antmicro; OldValue: TP_0.75mm_SMD; Value: TP_0.75mm_SMD; Footprint: antmicro-footprints:TP_SMD_0.75mm
TP35 = TP_0.75mm_SMD: License: Apache-2.0; Author: Antmicro; OldValue: TP_0.75mm_SMD; Value: TP_0.75mm_SMD; Footprint: antmicro-footprints:TP_SMD_0.75mm
TP44 = TP_0.75mm_SMD_2: License: Apache-2.0; Author: Antmicro; OldValue: TP_0.75mm_SMD; Value: TP_0.75mm_SMD; Footprint: antmicro-footprints:TP_SMD_0.75mm
U4 = NTS0102_XSON: Manufacturer 1: NXP; License: Apache-2.0; Author: Antmicro; OldValue: NTS0102_XSON; Manufacturer Part Number 1: NTS0102GT; Value: NTS0102GT; Footprint: antmicro-footprints:XSON-8_1x1.95mm_P0.5mm